# EAGLE schematic EV_Safety_Board (EAGLE 7.7.0)
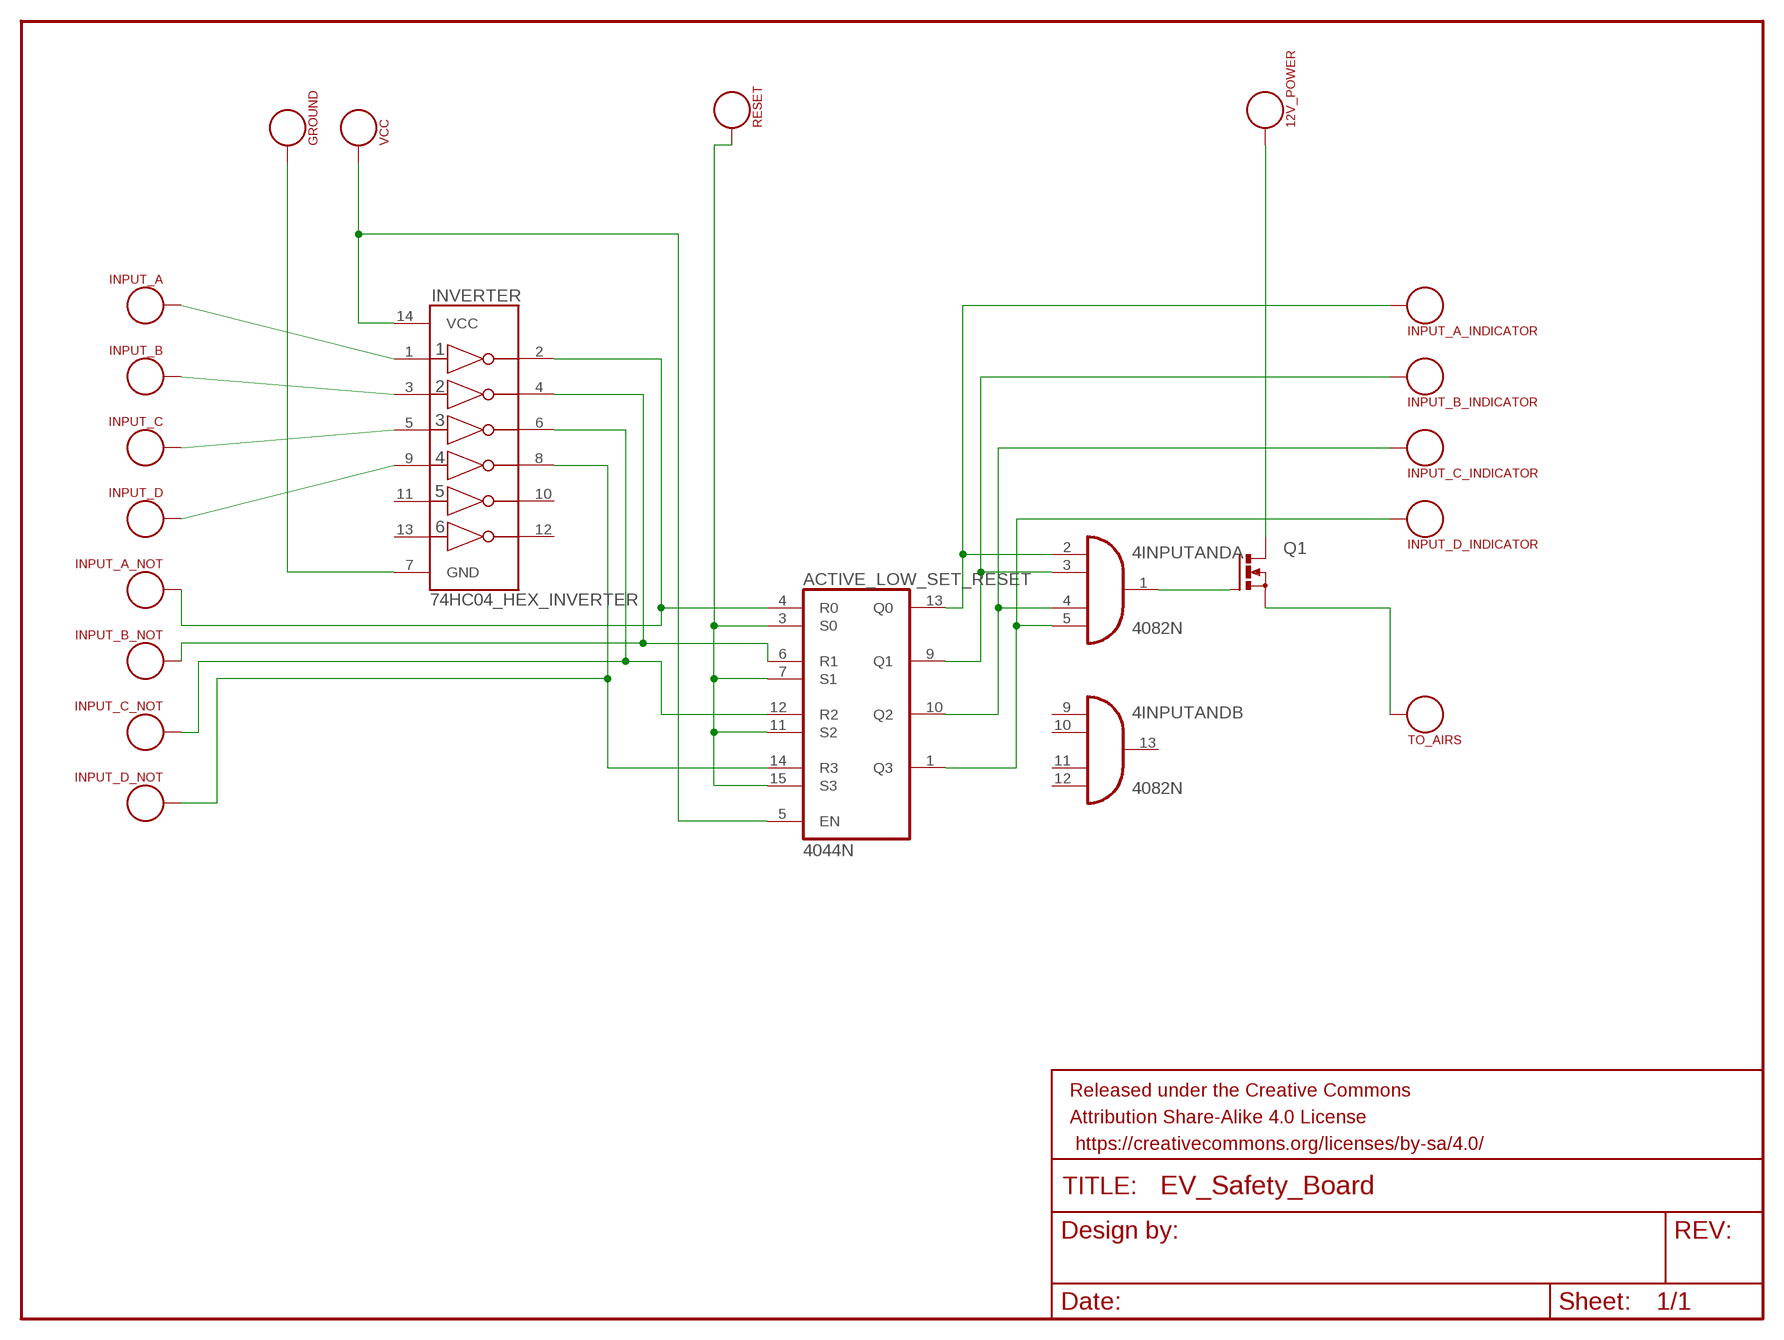
[diagram p0: schematic, sheet 1]

## Parts
4INPUTAND  4082N  [DIL14]
12V_POWER  SEW_HOLE  [SIMPLE_HOLE]
ACTIVE_LOW_SET_RESET  4044N  [DIL16]
FRAME1  FRAME-LETTERNO_PACKAGE  [DUMMY]
GROUND  SEW_HOLE  [SIMPLE_HOLE]
INPUT_A  SEW_HOLE  [SIMPLE_HOLE]
INPUT_A_INDICATOR  SEW_HOLE  [SIMPLE_HOLE]
INPUT_A_NOT  SEW_HOLE  [SIMPLE_HOLE]
INPUT_B  SEW_HOLE  [SIMPLE_HOLE]
INPUT_B_INDICATOR  SEW_HOLE  [SIMPLE_HOLE]
INPUT_B_NOT  SEW_HOLE  [SIMPLE_HOLE]
INPUT_C  SEW_HOLE  [SIMPLE_HOLE]
INPUT_C_INDICATOR  SEW_HOLE  [SIMPLE_HOLE]
INPUT_C_NOT  SEW_HOLE  [SIMPLE_HOLE]
INPUT_D  SEW_HOLE  [SIMPLE_HOLE]
INPUT_D_INDICATOR  SEW_HOLE  [SIMPLE_HOLE]
INPUT_D_NOT  SEW_HOLE  [SIMPLE_HOLE]
INVERTER  74HC04_HEX_INVERTER  [DIL14]
Q1  PMOSFET_NTO220BH  [TO220BH]
RESET  SEW_HOLE  [SIMPLE_HOLE]
TO_AIRS  SEW_HOLE  [SIMPLE_HOLE]
VCC  SEW_HOLE  [SIMPLE_HOLE]

## Nets
N$1: 12V_POWER.P$1 Q1.D
N$2: INPUT_A.P$1 INVERTER.1(1A)
N$3: INPUT_B.P$1 INVERTER.3(2A)
N$4: INPUT_C.P$1 INVERTER.5(3A)
N$5: INPUT_D.P$1 INVERTER.9(4A)
N$6: ACTIVE_LOW_SET_RESET.3(S0) ACTIVE_LOW_SET_RESET.7(S1) ACTIVE_LOW_SET_RESET.11(S2) ACTIVE_LOW_SET_RESET.15(S3) RESET.P$1
N$7: ACTIVE_LOW_SET_RESET.6(R1) INPUT_B_NOT.P$1 INVERTER.4(2Y)
N$8: ACTIVE_LOW_SET_RESET.12(R2) INPUT_C_NOT.P$1 INVERTER.6(3Y)
N$9: ACTIVE_LOW_SET_RESET.14(R3) INPUT_D_NOT.P$1 INVERTER.8(4Y)
N$10: 4INPUTAND.4(A:I2) ACTIVE_LOW_SET_RESET.10(Q2) INPUT_C_INDICATOR.P$1
N$12: 4INPUTAND.3(A:I1) ACTIVE_LOW_SET_RESET.9(Q1) INPUT_B_INDICATOR.P$1
N$13: 4INPUTAND.2(A:I0) ACTIVE_LOW_SET_RESET.13(Q0) INPUT_A_INDICATOR.P$1
N$14: 4INPUTAND.1(A:O) Q1.G
N$15: Q1.S TO_AIRS.P$1
N$16: ACTIVE_LOW_SET_RESET.4(R0) INPUT_A_NOT.P$1 INVERTER.2(1Y)
N$17: GROUND.P$1 INVERTER.7(GND)
N$18: 4INPUTAND.5(A:I3) ACTIVE_LOW_SET_RESET.1(Q3) INPUT_D_INDICATOR.P$1
N$21: ACTIVE_LOW_SET_RESET.5(EN) INVERTER.14(VCC) VCC.P$1
Unconnected: 4INPUTAND.9(B:I0) 4INPUTAND.10(B:I1) 4INPUTAND.11(B:I2) 4INPUTAND.12(B:I3) 4INPUTAND.13(B:O) INVERTER.10(5Y) INVERTER.11(5A) INVERTER.12(6Y) INVERTER.13(6A)

## Power pins joined to a net without a drawn wire
VDD: 4INPUTAND.14(P:VDD) ACTIVE_LOW_SET_RESET.16(VDD)
VSS: 4INPUTAND.7(P:VSS) ACTIVE_LOW_SET_RESET.8(VSS)

## Library data of the parts
4INPUTAND = 40xx:4082: Dual 4-input AND
12V_POWER GROUND INPUT_A INPUT_A_INDICATOR INPUT_A_NOT INPUT_B INPUT_B_INDICATOR INPUT_B_NOT INPUT_C INPUT_C_INDICATOR INPUT_C_NOT INPUT_D INPUT_D_INDICATOR INPUT_D_NOT RESET TO_AIRS VCC = LilyPad-Wearables:SEW_HOLE: Simple sew-hole .1" diameter hole with 20mil annular ring
ACTIVE_LOW_SET_RESET = 40xx:4044: Quad 3-state NAND R/S LATCH
FRAME1 = SparkFun-Aesthetics:FRAME-LETTER: Schematic Frame Standard 8.5x11 US Letter frame; DESIGNER: Nobody; VERSION: v01
INVERTER = SparkFun-DigitalIC:74HC04_HEX_INVERTER: 74HC04 Hex Inverter
Q1 = transistor-power:PMOSFET_N: Power MOSFET N-Channel